# Altium schematic sheet Sheet1_Cpu.SchDoc
size A4
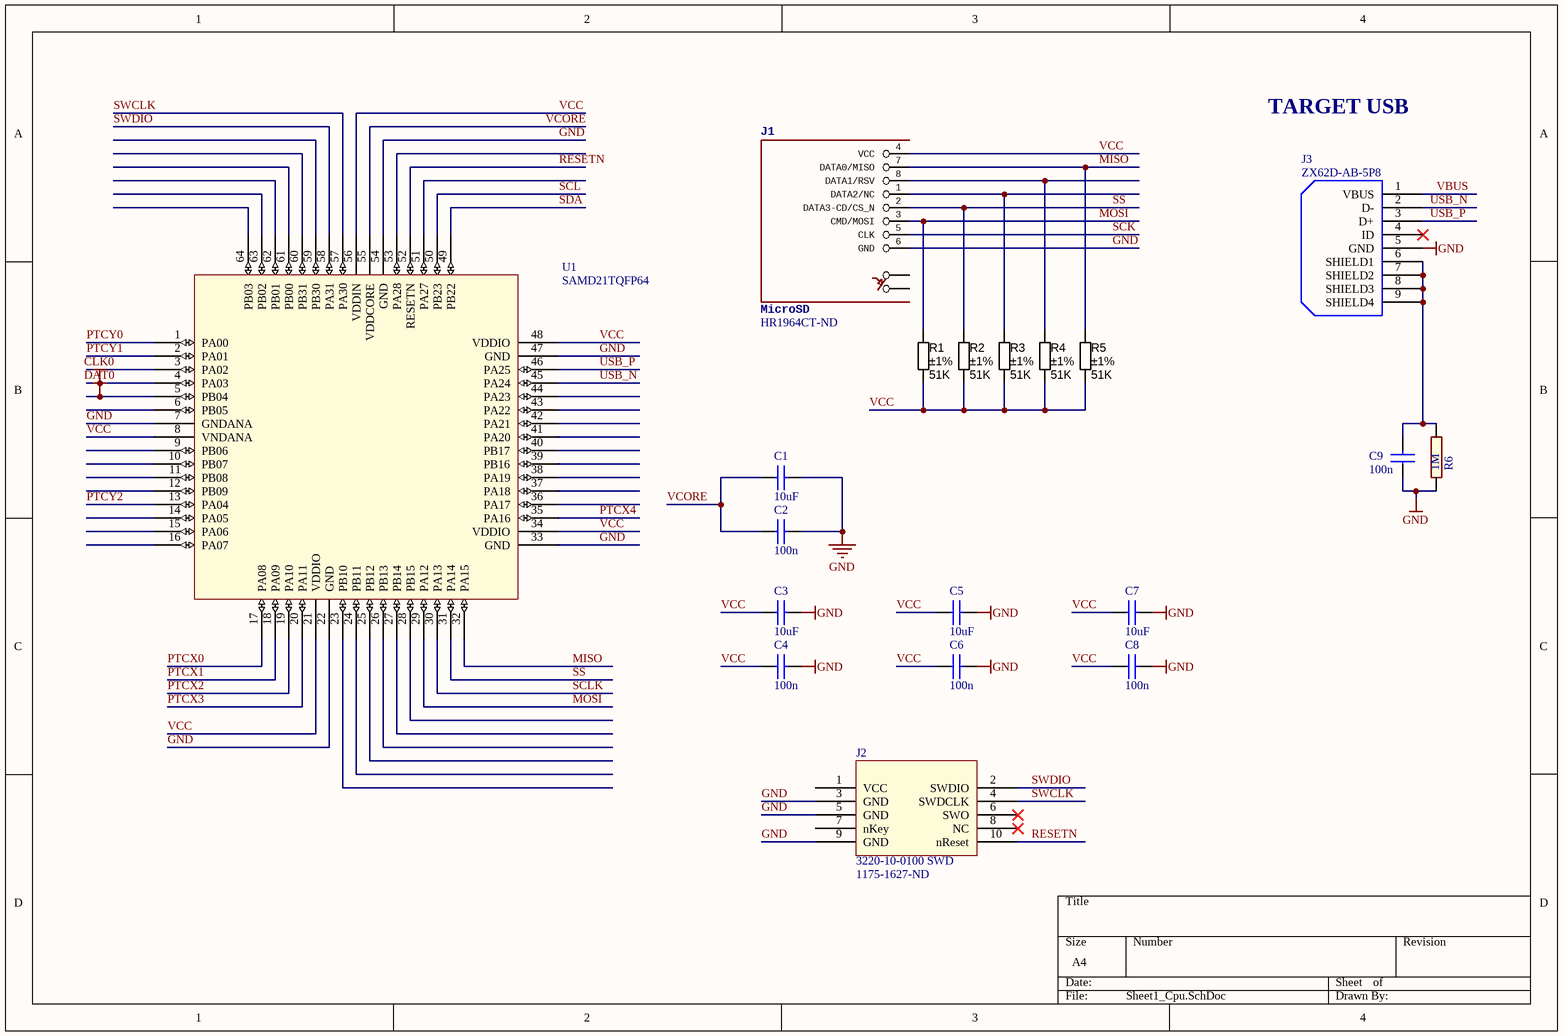
[diagram p0: Sheet1_Cpu.SchDoc]

## Parts
C1  value 10uF  [AP1-00041]
C2  value 100n  [AP1-00001]  (hidden comment: CAP-NONPOL)
C3  value 10uF  [AP1-00041]
C4  value 100n  [AP1-00001]  (hidden comment: CAP-NONPOL)
C5  value 10uF  [AP1-00041]
C6  value 100n  [AP1-00001]  (hidden comment: CAP-NONPOL)
C7  value 10uF  [AP1-00041]
C8  value 100n  [AP1-00001]  (hidden comment: CAP-NONPOL)
C9  value 100n  [AP1-00001]  (hidden comment: CAP-NONPOL)
J1  MicroSD  Supplier Part Number 1: HR1964CT-ND  [DM3AT-SF-PEJM5]
J2  3220-10-0100 SWD  Supplier Part Number 1: 1175-1627-ND  [3220-10-0100]
J3  ZX62D-AB-5P8  [AP8-00852]
R1  value 51K  Tolerance: ±1%  [RESC2012X70N]  (hidden comment: Thick Film)
R2  value 51K  Tolerance: ±1%  [RESC2012X70N]  (hidden comment: Thick Film)
R3  value 51K  Tolerance: ±1%  [RESC2012X70N]  (hidden comment: Thick Film)
R4  value 51K  Tolerance: ±1%  [RESC2012X70N]  (hidden comment: Thick Film)
R5  value 51K  Tolerance: ±1%  [RESC2012X70N]  (hidden comment: Thick Film)
R6  value 1M  [AP2-00011]  (hidden comment: R2)
U1  SAMD21TQFP64  [TSQFP50P1300X1300X120-64N]

## Nets
CLK0: U1.4(PA03)
DAT0: U1.5(PB04)
GND: C1.2 C2.2 C3.2 C4.2 C5.2 C6.2 C7.2 C8.2 C9.1 J1.6(GND) J2.3(GND) J2.5(GND) J2.9(GND) J3.5(GND) R6.1 U1.7(GNDANA) U1.22(GND) U1.33(GND) U1.47(GND) U1.54(GND)
MISO: J1.7(DATA0/MISO) R5.1 U1.32(PA15)
MOSI: J1.3(CMD/MOSI) R1.2 U1.29(PA12)
PTCX0: U1.17(PA08)
PTCX1: U1.18(PA09)
PTCX2: U1.19(PA10)
PTCX3: U1.20(PA11)
PTCX4: U1.35(PA16)
PTCY0: U1.1(PA00)
PTCY1: U1.2(PA01)
PTCY2: U1.13(PA04)
RESETN: J2.10(nReset) U1.52(RESETN)
SCK: J1.5(CLK)
SCL: U1.50(PB23)
SCLK: U1.30(PA13)
SDA: U1.49(PB22)
SS: J1.2(DATA3-CD/CS_N) R2.2 U1.31(PA14)
SWCLK: J2.4(SWDCLK) U1.57(PA30)
SWDIO: J2.2(SWDIO) U1.58(PA31)
USB_N: J3.2(D-) U1.45(PA24)
USB_P: J3.3(D+) U1.46(PA25)
VBUS: J3.1(VBUS)
VCC: C3.1 C4.1 C5.1 C6.1 C7.1 C8.1 J1.4(VCC) R1.1 R2.1 R3.2 R4.2 R5.2 U1.8(VNDANA) U1.21(VDDIO) U1.34(VDDIO) U1.48(VDDIO) U1.56(VDDIN)
VCORE: C1.1 C2.1 U1.55(VDDCORE)
NetC9_2: C9.2 J3.6(SHIELD1) J3.7(SHIELD2) J3.8(SHIELD3) J3.9(SHIELD4) R6.2
NetJ1_1: J1.1(DATA2/NC) R3.1
NetJ1_8: J1.8(DATA1/RSV) R4.1

Not connected (* = marked no-connect by the designer): J1 A B; J2 1(VCC) 6(SWO)* 7(nKey) 8(NC)*; J3 4(ID)*; U1 3(PA02) 6(PB05) 9(PB06) 10(PB07) 11(PB08) 12(PB09) 14(PA05) 15(PA06) 16(PA07) 23(PB10) 24(PB11) 25(PB12) 26(PB13) 27(PB14) 28(PB15) 36(PA17) 37(PA18) 38(PA19) 39(PB16) 40(PB17) 41(PA20) 42(PA21) 43(PA22) 44(PA23) 51(PA27) 53(PA28) 59(PB30) 60(PB31) 61(PB00) 62(PB01) 63(PB02) 64(PB03)

## Notes on the sheet
- TARGET USB

## Library data of the parts
C1 C3 C5 C7 = A01-0360: Ceramic capacitor, SMD 0805, X5R, 10V, 10 %, (de19441); PartGroup: Capacitors,Ceramic,SMD 0805; Manufacturer: Murata; MPN: GRM21BR61A106KE19L; Tolerance: 10%; TemperatureRange: -55 - +85 deg C; AN: A01-0360; Height: 1,25
C2 C4 C6 C8 C9 = A01-0246: Ceramic capacitor, SMD 0402, X7R, 16V, +/-10%; PartGroup: Capacitors,Ceramic,SMD 0402; Manufacturer: Kemet; MPN: C0402C104K4RACTU; TemperatureRange: -55 - +125 deg C; AN: A01-0246; Tolerance: 16V, +/-10%; Height: 0,5
J1 = DM3AT-SF-PEJM5: Hirose Electric Micro SD - DM3AT-SF-PEJM5; Supplier 1: Digi-Key
J2 = 3220-10-0100-00: HiRose 3220-10-0100 BOX HEADER, 0.050 10 POS; Supplier 1: Digi-Key
J3 = A08-2112: Hirose ZX62D-AB-5P8 Micro USB AB Connector, Standard SMT + DIP; PartGroup: Mechanical devices,Connectors,USB; AN: A08-2112; Value: ZX62D-AB-5P8; Height: 2,79999995231628
R1-R5 = RES_51K_0805_1%: Resistor SMD chip 51k Ohm 0.125W 1% 0805; Manufacturer 1: Yageo; Manufacturer Part Number 1: RC0805FR-0751KL; Ratings: 1/8W; SCDType: spec; Package / Case: 0805 (2012 Metric); Supplier 1: Digi-Key; Supplier Part Number 1: 311-51.0KCRCT-ND
R6 = A02-0284: Thick film resistor, SMD 0402, 1/16W, 1%; PartGroup: Resistors,SMD,0402 1%; Manufacturer: KOA; MPN: RK73H1ETTP1004F; TemperatureRange: -55 - +125 deg C; AN: A02-0284; Tolerance: 1 %; Height: 0,349999994039536
U1 = ATSAMD21J18A-AUT